# Altium project c1-12.PrjPCB (part 2 of 3)

## Sheet one_planar_sensor_connector_hall_crossboard_1_1.SchDoc
size A3
Used 8 times, as channels U_AD7768_inputs_hall_crossboard_1_1/meas_ch1, U_AD7768_inputs_hall_crossboard_1_1/meas_ch2, U_AD7768_inputs_hall_crossboard_1_1/meas_ch3, U_AD7768_inputs_hall_crossboard_1_1/meas_ch4, U_AD7768_inputs_hall_crossboard_1_1/meas_ch5, U_AD7768_inputs_hall_crossboard_1_1/meas_ch6, U_AD7768_inputs_hall_crossboard_1_1/meas_ch7, U_AD7768_inputs_hall_crossboard_1_1/meas_ch8. Parts and nets are listed once, with the designators drawn on the sheet.
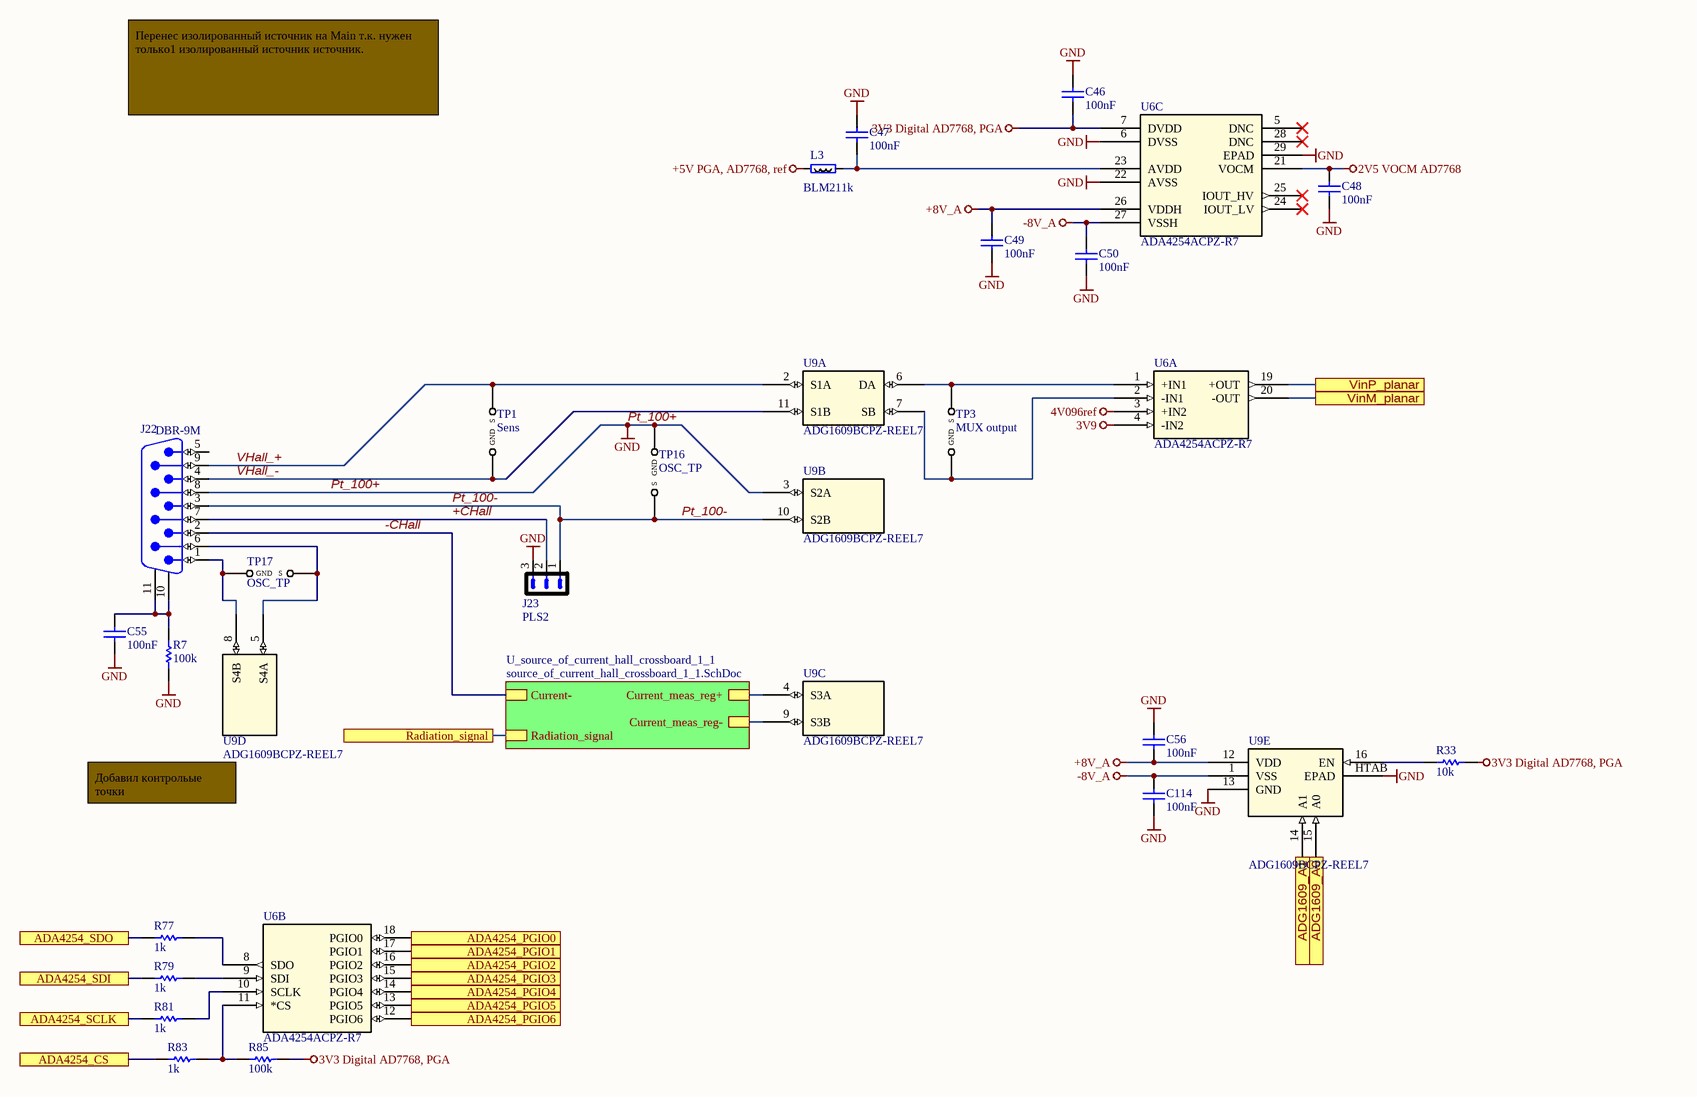
[diagram p7: one_planar_sensor_connector_hall_crossboard_1_1.SchDoc]

### Parts
C46  100nF  [0603C]
C47  100nF  [0603C]
C48  100nF  [0603C]
C49  100nF  [0603C]
C50  100nF  [0603C]
C55  100nF  [0603C]
C56  100nF  [0603C]
C114  100nF  [0603C]
J22  DBR-9M  [AMPHENOL_L717DFE09P1ATN]
J23  PLS2  [COMATEL_385.0358.1.03.400]
L3  BLM211k  [RESC2012X50N]
R7  100k  [0603R]
R33  10k  [0603R]
R77  1k  [0603R]
R79  1k  [0603R]
R81  1k  [0603R]
R83  1k  [0603R]
R85  100k  [0603R]
TP1  Sens  [TP2]
TP3  MUX output  [TP2]
TP16  OSC_TP  [TP2]
TP17  OSC_TP  [TP2]
U6  ADA4254ACPZ-R7  [CP-28-10_ADI-M]  (parts A,B,C of 3)
U9  ADG1609BCPZ-REEL7  [CP_16_22_ADI-M]  (parts A,B,C,D,E of 5)

### Sub-sheets
U_source_of_current_hall_crossboard_1_1 = source_of_current_hall_crossboard_1_1.SchDoc: Current-, Current_meas_reg+, Current_meas_reg-, Radiation_signal

### Ports
ADA4254_CS, ADA4254_PGIO0, ADA4254_PGIO1, ADA4254_PGIO2, ADA4254_PGIO3, ADA4254_PGIO4, ADA4254_PGIO5, ADA4254_PGIO6, ADA4254_SCLK, ADA4254_SDI, ADA4254_SDO, ADG1609_A0, ADG1609_A1, Radiation_signal, VinM_planar, VinP_planar

### Nets
2V5 VOCM AD7768: C48.2 U6.21(VOCM)
3V3 Digital AD7768, PGA: C46.1 R85.2 U6.7(DVDD)
3V9: U6.4(-IN2)
4V096ref: U6.3(+IN2)
+5V PGA, AD7768, ref: L3.1
+8V_A: C49.2 C56.1 U6.26(VDDH) U9.12(VDD)
-8V_A: C50.2 C114.2 U6.27(VSSH) U9.1(VSS)
Pt_100+: C46.2 C47.1 C48.1 C49.1 C50.1 C55.1 C56.2 C114.1 J22.8 J23.3 R7.1 TP16.2(GND) U6.6(DVSS) U6.22(AVSS) U6.29(EPAD) U9.3(S2A) U9.13(GND) U9.HTAB(EPAD)  [also labelled GND]
+CHall: J22.7 J23.2
-CHall: J22.2 ; sheet U_source_of_current_hall_crossboard_1_1/Current-
ADA4254_CS: R83.1 ; port ADA4254_CS
ADA4254_PGIO0: U6.18(PGIO0) ; port ADA4254_PGIO0
ADA4254_PGIO1: U6.17(PGIO1) ; port ADA4254_PGIO1
ADA4254_PGIO2: U6.16(PGIO2) ; port ADA4254_PGIO2
ADA4254_PGIO3: U6.15(PGIO3) ; port ADA4254_PGIO3
ADA4254_PGIO4: U6.14(PGIO4) ; port ADA4254_PGIO4
ADA4254_PGIO5: U6.13(PGIO5) ; port ADA4254_PGIO5
ADA4254_PGIO6: U6.12(PGIO6) ; port ADA4254_PGIO6
ADA4254_SCLK: R81.1 ; port ADA4254_SCLK
ADA4254_SDI: R79.1 ; port ADA4254_SDI
ADA4254_SDO: R77.1 ; port ADA4254_SDO
ADG1609_A0: U9.15(A0) ; port ADG1609_A0
ADG1609_A1: U9.14(A1) ; port ADG1609_A1
Pt_100-: J22.3 J23.1 TP16.1(S) U9.10(S2B)
Radiation_signal: port Radiation_signal, sheet U_source_of_current_hall_crossboard_1_1/Radiation_signal
VHall_+: J22.9 TP1.1(S) U9.2(S1A)
VHall_-: J22.4 TP1.2(GND) U9.11(S1B)
VinM_planar: U6.20(-OUT) ; port VinM_planar
VinP_planar: U6.19(+OUT) ; port VinP_planar
NetC47_2: C47.2 L3.2 U6.23(AVDD)
NetC55_2: C55.2 J22.10 J22.11 R7.2
NetJ22_1: J22.1 TP17.2(GND) U9.8(S4B)
NetJ22_6: J22.6 TP17.1(S) U9.5(S4A)
NetR33_1: R33.1 U9.16(EN)
NetR77_2: R77.2 U6.8(SDO)
NetR79_2: R79.2 U6.9(SDI)
NetR81_2: R81.2 U6.10(SCLK)
NetR83_2: R83.2 R85.1 U6.11(*CS)
NetTP3_1: TP3.1(S) U6.1(+IN1) U9.6(DA)
NetTP3_2: TP3.2(GND) U6.2(-IN1) U9.7(SB)
NetU9_4: U9.4(S3A) ; sheet U_source_of_current_hall_crossboard_1_1/Current_meas_reg+
NetU9_9: U9.9(S3B) ; sheet U_source_of_current_hall_crossboard_1_1/Current_meas_reg-

Not connected (* = marked no-connect by the designer): J22 5; R33 2; U6 5(DNC)* 24(IOUT_LV)* 25(IOUT_HV)* 28(DNC)*

### Channels
U_AD7768_inputs_hall_crossboard_1_1/meas_ch1: designators C46=meas_ch1_C46 C47=meas_ch1_C47 C48=meas_ch1_C48 C49=meas_ch1_C49 C50=meas_ch1_C50 C55=meas_ch1_C55 C56=meas_ch1_C56 C114=meas_ch1_C114 J22=meas_ch1_J22 J23=meas_ch1_J23 L3=meas_ch1_L3 R7=meas_ch1_R7 R33=meas_ch1_R33 R77=meas_ch1_R77 R79=meas_ch1_R79 R81=meas_ch1_R81 R83=meas_ch1_R83 R85=meas_ch1_R85 TP1=meas_ch1_TP1 TP3=meas_ch1_TP3 TP16=meas_ch1_TP16 TP17=meas_ch1_TP17 U6=meas_ch1_U6 U9=meas_ch1_U9; ports ADA4254_CS=ADA4254_CS ADA4254_PGIO0=ADA4254_PGIO0 ADA4254_PGIO1=ADA4254_PGIO1 ADA4254_PGIO2=ADA4254_PGIO2 ADA4254_PGIO3=ADA4254_PGIO3 ADA4254_PGIO4=ADA4254_PGIO4 ADA4254_PGIO5=Netmeas_ch1_U6_13 ADA4254_PGIO6=Netmeas_ch1_U6_12 ADA4254_SCLK=SCLK ADA4254_SDI=MOSI ADA4254_SDO=MISO ADG1609_A0=ADG1609_A0 ADG1609_A1=ADG1609_A1 Radiation_signal=Radiation_signal VinM_planar=VinM_planar1 VinP_planar=VinP_planar1
U_AD7768_inputs_hall_crossboard_1_1/meas_ch2: designators C46=meas_ch2_C46 C47=meas_ch2_C47 C48=meas_ch2_C48 C49=meas_ch2_C49 C50=meas_ch2_C50 C55=meas_ch2_C55 C56=meas_ch2_C56 C114=meas_ch2_C114 J22=meas_ch2_J22 J23=meas_ch2_J23 L3=meas_ch2_L3 R7=meas_ch2_R7 R33=meas_ch2_R33 R77=meas_ch2_R77 R79=meas_ch2_R79 R81=meas_ch2_R81 R83=meas_ch2_R83 R85=meas_ch2_R85 TP1=meas_ch2_TP1 TP3=meas_ch2_TP3 TP16=meas_ch2_TP16 TP17=meas_ch2_TP17 U6=meas_ch2_U6 U9=meas_ch2_U9; ports ADA4254_CS=ADA4254_CS ADA4254_PGIO0=ADA4254_PGIO0 ADA4254_PGIO1=ADA4254_PGIO1 ADA4254_PGIO2=ADA4254_PGIO2 ADA4254_PGIO3=ADA4254_PGIO3 ADA4254_PGIO4=ADA4254_PGIO4 ADA4254_PGIO5=Netmeas_ch1_U6_13 ADA4254_PGIO6=Netmeas_ch1_U6_12 ADA4254_SCLK=SCLK ADA4254_SDI=MOSI ADA4254_SDO=MISO ADG1609_A0=ADG1609_A0 ADG1609_A1=ADG1609_A1 Radiation_signal=Radiation_signal VinM_planar=VinM_planar2 VinP_planar=VinP_planar2
U_AD7768_inputs_hall_crossboard_1_1/meas_ch3: designators C46=meas_ch3_C46 C47=meas_ch3_C47 C48=meas_ch3_C48 C49=meas_ch3_C49 C50=meas_ch3_C50 C55=meas_ch3_C55 C56=meas_ch3_C56 C114=meas_ch3_C114 J22=meas_ch3_J22 J23=meas_ch3_J23 L3=meas_ch3_L3 R7=meas_ch3_R7 R33=meas_ch3_R33 R77=meas_ch3_R77 R79=meas_ch3_R79 R81=meas_ch3_R81 R83=meas_ch3_R83 R85=meas_ch3_R85 TP1=meas_ch3_TP1 TP3=meas_ch3_TP3 TP16=meas_ch3_TP16 TP17=meas_ch3_TP17 U6=meas_ch3_U6 U9=meas_ch3_U9; ports ADA4254_CS=ADA4254_CS ADA4254_PGIO0=ADA4254_PGIO0 ADA4254_PGIO1=ADA4254_PGIO1 ADA4254_PGIO2=ADA4254_PGIO2 ADA4254_PGIO3=ADA4254_PGIO3 ADA4254_PGIO4=ADA4254_PGIO4 ADA4254_PGIO5=Netmeas_ch1_U6_13 ADA4254_PGIO6=Netmeas_ch1_U6_12 ADA4254_SCLK=SCLK ADA4254_SDI=MOSI ADA4254_SDO=MISO ADG1609_A0=ADG1609_A0 ADG1609_A1=ADG1609_A1 Radiation_signal=Radiation_signal VinM_planar=VinM_planar3 VinP_planar=VinP_planar3
U_AD7768_inputs_hall_crossboard_1_1/meas_ch4: designators C46=meas_ch4_C46 C47=meas_ch4_C47 C48=meas_ch4_C48 C49=meas_ch4_C49 C50=meas_ch4_C50 C55=meas_ch4_C55 C56=meas_ch4_C56 C114=meas_ch4_C114 J22=meas_ch4_J22 J23=meas_ch4_J23 L3=meas_ch4_L3 R7=meas_ch4_R7 R33=meas_ch4_R33 R77=meas_ch4_R77 R79=meas_ch4_R79 R81=meas_ch4_R81 R83=meas_ch4_R83 R85=meas_ch4_R85 TP1=meas_ch4_TP1 TP3=meas_ch4_TP3 TP16=meas_ch4_TP16 TP17=meas_ch4_TP17 U6=meas_ch4_U6 U9=meas_ch4_U9; ports ADA4254_CS=ADA4254_CS ADA4254_PGIO0=ADA4254_PGIO0 ADA4254_PGIO1=ADA4254_PGIO1 ADA4254_PGIO2=ADA4254_PGIO2 ADA4254_PGIO3=ADA4254_PGIO3 ADA4254_PGIO4=ADA4254_PGIO4 ADA4254_PGIO5=Netmeas_ch1_U6_13 ADA4254_PGIO6=Netmeas_ch1_U6_12 ADA4254_SCLK=SCLK ADA4254_SDI=MOSI ADA4254_SDO=MISO ADG1609_A0=ADG1609_A0 ADG1609_A1=ADG1609_A1 Radiation_signal=Radiation_signal VinM_planar=VinM_planar4 VinP_planar=VinP_planar4
U_AD7768_inputs_hall_crossboard_1_1/meas_ch5: designators C46=meas_ch5_C46 C47=meas_ch5_C47 C48=meas_ch5_C48 C49=meas_ch5_C49 C50=meas_ch5_C50 C55=meas_ch5_C55 C56=meas_ch5_C56 C114=meas_ch5_C114 J22=meas_ch5_J22 J23=meas_ch5_J23 L3=meas_ch5_L3 R7=meas_ch5_R7 R33=meas_ch5_R33 R77=meas_ch5_R77 R79=meas_ch5_R79 R81=meas_ch5_R81 R83=meas_ch5_R83 R85=meas_ch5_R85 TP1=meas_ch5_TP1 TP3=meas_ch5_TP3 TP16=meas_ch5_TP16 TP17=meas_ch5_TP17 U6=meas_ch5_U6 U9=meas_ch5_U9; ports ADA4254_CS=ADA4254_CS ADA4254_PGIO0=ADA4254_PGIO0 ADA4254_PGIO1=ADA4254_PGIO1 ADA4254_PGIO2=ADA4254_PGIO2 ADA4254_PGIO3=ADA4254_PGIO3 ADA4254_PGIO4=ADA4254_PGIO4 ADA4254_PGIO5=Netmeas_ch1_U6_13 ADA4254_PGIO6=Netmeas_ch1_U6_12 ADA4254_SCLK=SCLK ADA4254_SDI=MOSI ADA4254_SDO=MISO ADG1609_A0=ADG1609_A0 ADG1609_A1=ADG1609_A1 Radiation_signal=Radiation_signal VinM_planar=VinM_planar5 VinP_planar=VinP_planar5
U_AD7768_inputs_hall_crossboard_1_1/meas_ch6: designators C46=meas_ch6_C46 C47=meas_ch6_C47 C48=meas_ch6_C48 C49=meas_ch6_C49 C50=meas_ch6_C50 C55=meas_ch6_C55 C56=meas_ch6_C56 C114=meas_ch6_C114 J22=meas_ch6_J22 J23=meas_ch6_J23 L3=meas_ch6_L3 R7=meas_ch6_R7 R33=meas_ch6_R33 R77=meas_ch6_R77 R79=meas_ch6_R79 R81=meas_ch6_R81 R83=meas_ch6_R83 R85=meas_ch6_R85 TP1=meas_ch6_TP1 TP3=meas_ch6_TP3 TP16=meas_ch6_TP16 TP17=meas_ch6_TP17 U6=meas_ch6_U6 U9=meas_ch6_U9; ports ADA4254_CS=ADA4254_CS ADA4254_PGIO0=ADA4254_PGIO0 ADA4254_PGIO1=ADA4254_PGIO1 ADA4254_PGIO2=ADA4254_PGIO2 ADA4254_PGIO3=ADA4254_PGIO3 ADA4254_PGIO4=ADA4254_PGIO4 ADA4254_PGIO5=Netmeas_ch1_U6_13 ADA4254_PGIO6=Netmeas_ch1_U6_12 ADA4254_SCLK=SCLK ADA4254_SDI=MOSI ADA4254_SDO=MISO ADG1609_A0=ADG1609_A0 ADG1609_A1=ADG1609_A1 Radiation_signal=Radiation_signal VinM_planar=VinM_planar6 VinP_planar=VinP_planar6
U_AD7768_inputs_hall_crossboard_1_1/meas_ch7: designators C46=meas_ch7_C46 C47=meas_ch7_C47 C48=meas_ch7_C48 C49=meas_ch7_C49 C50=meas_ch7_C50 C55=meas_ch7_C55 C56=meas_ch7_C56 C114=meas_ch7_C114 J22=meas_ch7_J22 J23=meas_ch7_J23 L3=meas_ch7_L3 R7=meas_ch7_R7 R33=meas_ch7_R33 R77=meas_ch7_R77 R79=meas_ch7_R79 R81=meas_ch7_R81 R83=meas_ch7_R83 R85=meas_ch7_R85 TP1=meas_ch7_TP1 TP3=meas_ch7_TP3 TP16=meas_ch7_TP16 TP17=meas_ch7_TP17 U6=meas_ch7_U6 U9=meas_ch7_U9; ports ADA4254_CS=ADA4254_CS ADA4254_PGIO0=ADA4254_PGIO0 ADA4254_PGIO1=ADA4254_PGIO1 ADA4254_PGIO2=ADA4254_PGIO2 ADA4254_PGIO3=ADA4254_PGIO3 ADA4254_PGIO4=ADA4254_PGIO4 ADA4254_PGIO5=Netmeas_ch1_U6_13 ADA4254_PGIO6=Netmeas_ch1_U6_12 ADA4254_SCLK=SCLK ADA4254_SDI=MOSI ADA4254_SDO=MISO ADG1609_A0=ADG1609_A0 ADG1609_A1=ADG1609_A1 Radiation_signal=Radiation_signal VinM_planar=VinM_planar7 VinP_planar=VinP_planar7
U_AD7768_inputs_hall_crossboard_1_1/meas_ch8: designators C46=meas_ch8_C46 C47=meas_ch8_C47 C48=meas_ch8_C48 C49=meas_ch8_C49 C50=meas_ch8_C50 C55=meas_ch8_C55 C56=meas_ch8_C56 C114=meas_ch8_C114 J22=meas_ch8_J22 J23=meas_ch8_J23 L3=meas_ch8_L3 R7=meas_ch8_R7 R33=meas_ch8_R33 R77=meas_ch8_R77 R79=meas_ch8_R79 R81=meas_ch8_R81 R83=meas_ch8_R83 R85=meas_ch8_R85 TP1=meas_ch8_TP1 TP3=meas_ch8_TP3 TP16=meas_ch8_TP16 TP17=meas_ch8_TP17 U6=meas_ch8_U6 U9=meas_ch8_U9; ports ADA4254_CS=ADA4254_CS ADA4254_PGIO0=ADA4254_PGIO0 ADA4254_PGIO1=ADA4254_PGIO1 ADA4254_PGIO2=ADA4254_PGIO2 ADA4254_PGIO3=ADA4254_PGIO3 ADA4254_PGIO4=ADA4254_PGIO4 ADA4254_PGIO5=Netmeas_ch1_U6_13 ADA4254_PGIO6=Netmeas_ch1_U6_12 ADA4254_SCLK=SCLK ADA4254_SDI=MOSI ADA4254_SDO=MISO ADG1609_A0=ADG1609_A0 ADG1609_A1=ADG1609_A1 Radiation_signal=Radiation_signal VinM_planar=VinM_planar8 VinP_planar=VinP_planar8

### Notes on the sheet
- Перенес изолированный источник на Main т.к. нужен только1 изолированный источник источник.
- Добавил контрольые точки
- Labels drawn without touching a wire or pin: 3V3 Digital AD7768, PGA

### Library data of the parts
C46-C50 C55 C56 C114 = Capacitor_ST: Capacitor 0402 / 0603 / 0805; Revision: July-2002: Re-released for DXP Platform.; Value: 100nF
J22 = D_SUB_9M: Вилка  DSUB 9 угловая; Vendor: Connfly; SMD Solders: 0; Solder Option: RM; THD Solders: 11; Name to order: DRB- 9MA (DBR-9M) (DS1037-9M); Price: 50; Device: DBR-9M
J23 = PLS3: Vendor: Confly; SMD Solders: 0; Solder Option: RM; THD Solders: 2; Price: 1; Device: PLS2
L3 = BLM21: SMD Ferrite bead 0805; Vendor: Vishay; Value: 1k; Pkg: SMD0805; SMD Solders: 2; Solder Option: RM; Device: BLM21; Price: 10
R7 R33 R77 R79 R81 R83 R85 = Resistor_ST: Resistor 0402 / 0603 / 0805
  R7 R85: Value: 100k
  R33: Value: 10k
  R77 R79 R81 R83: Value: 1k
TP1 TP3 TP16 TP17 = OscTP: Контрольная точка для подключения осциллографа короткой землёй; Vendor: PCB; Price: 0; SolderOption: PCB
  TP1: Value: Sens
  TP3: Value: MUX output
  TP16 TP17: Value: OSC_TP
U6 = ADA4254ACPZ-R7: No Description Available; Mfr_Name: Analog Devices Inc; Digi-Key_Part_Number_1: 505-ADA4254ACPZ-R7TR-ND; RefDes: RefDes; Type: Type
U9 = ADG1609BCPZ-REEL7: No Description Available; Mfr_Name: Analog Devices Inc; RefDes: RefDes; Type: Type

## Sheet source_of_current_hall_crossboard_1_1.SchDoc
size A4
Used 8 times, as channels U_AD7768_inputs_hall_crossboard_1_1/meas_ch1/U_source_of_current_hall_crossboard_1_1, U_AD7768_inputs_hall_crossboard_1_1/meas_ch2/U_source_of_current_hall_crossboard_1_1, U_AD7768_inputs_hall_crossboard_1_1/meas_ch3/U_source_of_current_hall_crossboard_1_1, U_AD7768_inputs_hall_crossboard_1_1/meas_ch4/U_source_of_current_hall_crossboard_1_1, U_AD7768_inputs_hall_crossboard_1_1/meas_ch5/U_source_of_current_hall_crossboard_1_1, U_AD7768_inputs_hall_crossboard_1_1/meas_ch6/U_source_of_current_hall_crossboard_1_1, U_AD7768_inputs_hall_crossboard_1_1/meas_ch7/U_source_of_current_hall_crossboard_1_1, U_AD7768_inputs_hall_crossboard_1_1/meas_ch8/U_source_of_current_hall_crossboard_1_1. Parts and nets are listed once, with the designators drawn on the sheet.
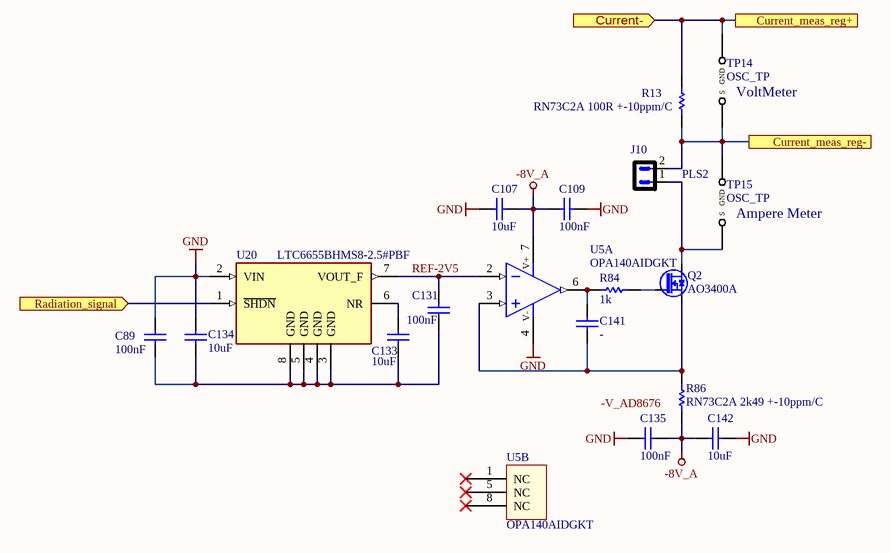
[diagram p8: source_of_current_hall_crossboard_1_1.SchDoc]

### Parts
C89  100nF  [0603C]
C107  10uF  [0805C]
C109  100nF  [0603C]
C131  100nF  [0603C]
C133  10uF  [0805C]
C134  10uF  [0805C]
C135  100nF  [0603C]
C141  -  [0603C]
C142  10uF  [0805C]
J10  PLS2  [SAMTEC_TSW-102-23-L-S]
Q2  AO3400A  [SOT95P229X119-3N]
R13  RN73C2A 100R +-10ppm/C  [0805R]
R84  1k  [0805R]
R86  RN73C2A 2k49 +-10ppm/C  [0805R]
TP14  OSC_TP  [TP2]
TP15  OSC_TP  [TP2]
U5  OPA140AIDGKT  [SOP65P490X110-8N]  (parts A,B of 2)
U20  LTC6655BHMS8-2.5#PBF  [SOP65P490X110-8N]

### Ports
Current- (in), Current_meas_reg+, Current_meas_reg-, Radiation_signal (in)

### Nets
-8V_A: C107.1 C109.1 C135.1 C142.1 R86.1 U5.7(V+)
GND: C89.2 C107.2 C109.2 C134.2 C135.2 C142.2 U5.4(V-) U20.2(VIN)
Current-: R13.2 TP14.2(GND) ; port Current-, port Current_meas_reg+
Current_meas_reg-: J10.2 R13.1 TP14.1(S) TP15.2(GND) ; port Current_meas_reg-
Radiation_signal: U20.1(~{SHDN}) ; port Radiation_signal
REF-2V5: C131.2 U5.2(IN-) U20.7(VOUT_F)
NetC89_1: C89.1 C131.1 C133.1 C134.1 U20.3(GND) U20.4(GND) U20.5(GND) U20.8(GND)
NetC133_2: C133.2 U20.6(NR)
NetC141_1: C141.1 Q2.2(S) R86.2 U5.3(IN+)
NetC141_2: C141.2 R84.1 U5.6(OUT)
NetJ10_1: J10.1 Q2.3(D) TP15.1(S)
NetQ2_1: Q2.1(G) R84.2

Not connected (* = marked no-connect by the designer): U5 1(NC)* 5(NC)* 8(NC)*

### Channels
U_AD7768_inputs_hall_crossboard_1_1/meas_ch1/U_source_of_current_hall_crossboard_1_1: designators C89=U_AD7768_inputs_hall_crossboard_1_1_meas_ch1_U_source_of_current_hall_crossboard_1_1_C89 C107=U_AD7768_inputs_hall_crossboard_1_1_meas_ch1_U_source_of_current_hall_crossboard_1_1_C107 C109=U_AD7768_inputs_hall_crossboard_1_1_meas_ch1_U_source_of_current_hall_crossboard_1_1_C109 C131=U_AD7768_inputs_hall_crossboard_1_1_meas_ch1_U_source_of_current_hall_crossboard_1_1_C131 C133=U_AD7768_inputs_hall_crossboard_1_1_meas_ch1_U_source_of_current_hall_crossboard_1_1_C133 C134=U_AD7768_inputs_hall_crossboard_1_1_meas_ch1_U_source_of_current_hall_crossboard_1_1_C134 C135=U_AD7768_inputs_hall_crossboard_1_1_meas_ch1_U_source_of_current_hall_crossboard_1_1_C135 C141=U_AD7768_inputs_hall_crossboard_1_1_meas_ch1_U_source_of_current_hall_crossboard_1_1_C141 C142=U_AD7768_inputs_hall_crossboard_1_1_meas_ch1_U_source_of_current_hall_crossboard_1_1_C142 J10=U_AD7768_inputs_hall_crossboard_1_1_meas_ch1_U_source_of_current_hall_crossboard_1_1_J10 Q2=U_AD7768_inputs_hall_crossboard_1_1_meas_ch1_U_source_of_current_hall_crossboard_1_1_Q2 R13=U_AD7768_inputs_hall_crossboard_1_1_meas_ch1_U_source_of_current_hall_crossboard_1_1_R13 R84=U_AD7768_inputs_hall_crossboard_1_1_meas_ch1_U_source_of_current_hall_crossboard_1_1_R84 R86=U_AD7768_inputs_hall_crossboard_1_1_meas_ch1_U_source_of_current_hall_crossboard_1_1_R86 TP14=U_AD7768_inputs_hall_crossboard_1_1_meas_ch1_U_source_of_current_hall_crossboard_1_1_TP14 TP15=U_AD7768_inputs_hall_crossboard_1_1_meas_ch1_U_source_of_current_hall_crossboard_1_1_TP15 U5=U_AD7768_inputs_hall_crossboard_1_1_meas_ch1_U_source_of_current_hall_crossboard_1_1_U5 U20=U_AD7768_inputs_hall_crossboard_1_1_meas_ch1_U_source_of_current_hall_crossboard_1_1_U20; ports Current-=-CHall_meas_ch1 Current_meas_reg+=-CHall_meas_ch1 Current_meas_reg-=Netmeas_ch1_U9_9 Radiation_signal=Radiation_signal
U_AD7768_inputs_hall_crossboard_1_1/meas_ch2/U_source_of_current_hall_crossboard_1_1: designators C89=U_AD7768_inputs_hall_crossboard_1_1_meas_ch2_U_source_of_current_hall_crossboard_1_1_C89 C107=U_AD7768_inputs_hall_crossboard_1_1_meas_ch2_U_source_of_current_hall_crossboard_1_1_C107 C109=U_AD7768_inputs_hall_crossboard_1_1_meas_ch2_U_source_of_current_hall_crossboard_1_1_C109 C131=U_AD7768_inputs_hall_crossboard_1_1_meas_ch2_U_source_of_current_hall_crossboard_1_1_C131 C133=U_AD7768_inputs_hall_crossboard_1_1_meas_ch2_U_source_of_current_hall_crossboard_1_1_C133 C134=U_AD7768_inputs_hall_crossboard_1_1_meas_ch2_U_source_of_current_hall_crossboard_1_1_C134 C135=U_AD7768_inputs_hall_crossboard_1_1_meas_ch2_U_source_of_current_hall_crossboard_1_1_C135 C141=U_AD7768_inputs_hall_crossboard_1_1_meas_ch2_U_source_of_current_hall_crossboard_1_1_C141 C142=U_AD7768_inputs_hall_crossboard_1_1_meas_ch2_U_source_of_current_hall_crossboard_1_1_C142 J10=U_AD7768_inputs_hall_crossboard_1_1_meas_ch2_U_source_of_current_hall_crossboard_1_1_J10 Q2=U_AD7768_inputs_hall_crossboard_1_1_meas_ch2_U_source_of_current_hall_crossboard_1_1_Q2 R13=U_AD7768_inputs_hall_crossboard_1_1_meas_ch2_U_source_of_current_hall_crossboard_1_1_R13 R84=U_AD7768_inputs_hall_crossboard_1_1_meas_ch2_U_source_of_current_hall_crossboard_1_1_R84 R86=U_AD7768_inputs_hall_crossboard_1_1_meas_ch2_U_source_of_current_hall_crossboard_1_1_R86 TP14=U_AD7768_inputs_hall_crossboard_1_1_meas_ch2_U_source_of_current_hall_crossboard_1_1_TP14 TP15=U_AD7768_inputs_hall_crossboard_1_1_meas_ch2_U_source_of_current_hall_crossboard_1_1_TP15 U5=U_AD7768_inputs_hall_crossboard_1_1_meas_ch2_U_source_of_current_hall_crossboard_1_1_U5 U20=U_AD7768_inputs_hall_crossboard_1_1_meas_ch2_U_source_of_current_hall_crossboard_1_1_U20; ports Current-=-CHall_meas_ch2 Current_meas_reg+=-CHall_meas_ch2 Current_meas_reg-=Netmeas_ch2_U9_9 Radiation_signal=Radiation_signal
U_AD7768_inputs_hall_crossboard_1_1/meas_ch3/U_source_of_current_hall_crossboard_1_1: designators C89=U_AD7768_inputs_hall_crossboard_1_1_meas_ch3_U_source_of_current_hall_crossboard_1_1_C89 C107=U_AD7768_inputs_hall_crossboard_1_1_meas_ch3_U_source_of_current_hall_crossboard_1_1_C107 C109=U_AD7768_inputs_hall_crossboard_1_1_meas_ch3_U_source_of_current_hall_crossboard_1_1_C109 C131=U_AD7768_inputs_hall_crossboard_1_1_meas_ch3_U_source_of_current_hall_crossboard_1_1_C131 C133=U_AD7768_inputs_hall_crossboard_1_1_meas_ch3_U_source_of_current_hall_crossboard_1_1_C133 C134=U_AD7768_inputs_hall_crossboard_1_1_meas_ch3_U_source_of_current_hall_crossboard_1_1_C134 C135=U_AD7768_inputs_hall_crossboard_1_1_meas_ch3_U_source_of_current_hall_crossboard_1_1_C135 C141=U_AD7768_inputs_hall_crossboard_1_1_meas_ch3_U_source_of_current_hall_crossboard_1_1_C141 C142=U_AD7768_inputs_hall_crossboard_1_1_meas_ch3_U_source_of_current_hall_crossboard_1_1_C142 J10=U_AD7768_inputs_hall_crossboard_1_1_meas_ch3_U_source_of_current_hall_crossboard_1_1_J10 Q2=U_AD7768_inputs_hall_crossboard_1_1_meas_ch3_U_source_of_current_hall_crossboard_1_1_Q2 R13=U_AD7768_inputs_hall_crossboard_1_1_meas_ch3_U_source_of_current_hall_crossboard_1_1_R13 R84=U_AD7768_inputs_hall_crossboard_1_1_meas_ch3_U_source_of_current_hall_crossboard_1_1_R84 R86=U_AD7768_inputs_hall_crossboard_1_1_meas_ch3_U_source_of_current_hall_crossboard_1_1_R86 TP14=U_AD7768_inputs_hall_crossboard_1_1_meas_ch3_U_source_of_current_hall_crossboard_1_1_TP14 TP15=U_AD7768_inputs_hall_crossboard_1_1_meas_ch3_U_source_of_current_hall_crossboard_1_1_TP15 U5=U_AD7768_inputs_hall_crossboard_1_1_meas_ch3_U_source_of_current_hall_crossboard_1_1_U5 U20=U_AD7768_inputs_hall_crossboard_1_1_meas_ch3_U_source_of_current_hall_crossboard_1_1_U20; ports Current-=-CHall_meas_ch3 Current_meas_reg+=-CHall_meas_ch3 Current_meas_reg-=Netmeas_ch3_U9_9 Radiation_signal=Radiation_signal
U_AD7768_inputs_hall_crossboard_1_1/meas_ch4/U_source_of_current_hall_crossboard_1_1: designators C89=U_AD7768_inputs_hall_crossboard_1_1_meas_ch4_U_source_of_current_hall_crossboard_1_1_C89 C107=U_AD7768_inputs_hall_crossboard_1_1_meas_ch4_U_source_of_current_hall_crossboard_1_1_C107 C109=U_AD7768_inputs_hall_crossboard_1_1_meas_ch4_U_source_of_current_hall_crossboard_1_1_C109 C131=U_AD7768_inputs_hall_crossboard_1_1_meas_ch4_U_source_of_current_hall_crossboard_1_1_C131 C133=U_AD7768_inputs_hall_crossboard_1_1_meas_ch4_U_source_of_current_hall_crossboard_1_1_C133 C134=U_AD7768_inputs_hall_crossboard_1_1_meas_ch4_U_source_of_current_hall_crossboard_1_1_C134 C135=U_AD7768_inputs_hall_crossboard_1_1_meas_ch4_U_source_of_current_hall_crossboard_1_1_C135 C141=U_AD7768_inputs_hall_crossboard_1_1_meas_ch4_U_source_of_current_hall_crossboard_1_1_C141 C142=U_AD7768_inputs_hall_crossboard_1_1_meas_ch4_U_source_of_current_hall_crossboard_1_1_C142 J10=U_AD7768_inputs_hall_crossboard_1_1_meas_ch4_U_source_of_current_hall_crossboard_1_1_J10 Q2=U_AD7768_inputs_hall_crossboard_1_1_meas_ch4_U_source_of_current_hall_crossboard_1_1_Q2 R13=U_AD7768_inputs_hall_crossboard_1_1_meas_ch4_U_source_of_current_hall_crossboard_1_1_R13 R84=U_AD7768_inputs_hall_crossboard_1_1_meas_ch4_U_source_of_current_hall_crossboard_1_1_R84 R86=U_AD7768_inputs_hall_crossboard_1_1_meas_ch4_U_source_of_current_hall_crossboard_1_1_R86 TP14=U_AD7768_inputs_hall_crossboard_1_1_meas_ch4_U_source_of_current_hall_crossboard_1_1_TP14 TP15=U_AD7768_inputs_hall_crossboard_1_1_meas_ch4_U_source_of_current_hall_crossboard_1_1_TP15 U5=U_AD7768_inputs_hall_crossboard_1_1_meas_ch4_U_source_of_current_hall_crossboard_1_1_U5 U20=U_AD7768_inputs_hall_crossboard_1_1_meas_ch4_U_source_of_current_hall_crossboard_1_1_U20; ports Current-=-CHall_meas_ch4 Current_meas_reg+=-CHall_meas_ch4 Current_meas_reg-=Netmeas_ch4_U9_9 Radiation_signal=Radiation_signal
U_AD7768_inputs_hall_crossboard_1_1/meas_ch5/U_source_of_current_hall_crossboard_1_1: designators C89=U_AD7768_inputs_hall_crossboard_1_1_meas_ch5_U_source_of_current_hall_crossboard_1_1_C89 C107=U_AD7768_inputs_hall_crossboard_1_1_meas_ch5_U_source_of_current_hall_crossboard_1_1_C107 C109=U_AD7768_inputs_hall_crossboard_1_1_meas_ch5_U_source_of_current_hall_crossboard_1_1_C109 C131=U_AD7768_inputs_hall_crossboard_1_1_meas_ch5_U_source_of_current_hall_crossboard_1_1_C131 C133=U_AD7768_inputs_hall_crossboard_1_1_meas_ch5_U_source_of_current_hall_crossboard_1_1_C133 C134=U_AD7768_inputs_hall_crossboard_1_1_meas_ch5_U_source_of_current_hall_crossboard_1_1_C134 C135=U_AD7768_inputs_hall_crossboard_1_1_meas_ch5_U_source_of_current_hall_crossboard_1_1_C135 C141=U_AD7768_inputs_hall_crossboard_1_1_meas_ch5_U_source_of_current_hall_crossboard_1_1_C141 C142=U_AD7768_inputs_hall_crossboard_1_1_meas_ch5_U_source_of_current_hall_crossboard_1_1_C142 J10=U_AD7768_inputs_hall_crossboard_1_1_meas_ch5_U_source_of_current_hall_crossboard_1_1_J10 Q2=U_AD7768_inputs_hall_crossboard_1_1_meas_ch5_U_source_of_current_hall_crossboard_1_1_Q2 R13=U_AD7768_inputs_hall_crossboard_1_1_meas_ch5_U_source_of_current_hall_crossboard_1_1_R13 R84=U_AD7768_inputs_hall_crossboard_1_1_meas_ch5_U_source_of_current_hall_crossboard_1_1_R84 R86=U_AD7768_inputs_hall_crossboard_1_1_meas_ch5_U_source_of_current_hall_crossboard_1_1_R86 TP14=U_AD7768_inputs_hall_crossboard_1_1_meas_ch5_U_source_of_current_hall_crossboard_1_1_TP14 TP15=U_AD7768_inputs_hall_crossboard_1_1_meas_ch5_U_source_of_current_hall_crossboard_1_1_TP15 U5=U_AD7768_inputs_hall_crossboard_1_1_meas_ch5_U_source_of_current_hall_crossboard_1_1_U5 U20=U_AD7768_inputs_hall_crossboard_1_1_meas_ch5_U_source_of_current_hall_crossboard_1_1_U20; ports Current-=-CHall_meas_ch5 Current_meas_reg+=-CHall_meas_ch5 Current_meas_reg-=Netmeas_ch5_U9_9 Radiation_signal=Radiation_signal
U_AD7768_inputs_hall_crossboard_1_1/meas_ch6/U_source_of_current_hall_crossboard_1_1: designators C89=U_AD7768_inputs_hall_crossboard_1_1_meas_ch6_U_source_of_current_hall_crossboard_1_1_C89 C107=U_AD7768_inputs_hall_crossboard_1_1_meas_ch6_U_source_of_current_hall_crossboard_1_1_C107 C109=U_AD7768_inputs_hall_crossboard_1_1_meas_ch6_U_source_of_current_hall_crossboard_1_1_C109 C131=U_AD7768_inputs_hall_crossboard_1_1_meas_ch6_U_source_of_current_hall_crossboard_1_1_C131 C133=U_AD7768_inputs_hall_crossboard_1_1_meas_ch6_U_source_of_current_hall_crossboard_1_1_C133 C134=U_AD7768_inputs_hall_crossboard_1_1_meas_ch6_U_source_of_current_hall_crossboard_1_1_C134 C135=U_AD7768_inputs_hall_crossboard_1_1_meas_ch6_U_source_of_current_hall_crossboard_1_1_C135 C141=U_AD7768_inputs_hall_crossboard_1_1_meas_ch6_U_source_of_current_hall_crossboard_1_1_C141 C142=U_AD7768_inputs_hall_crossboard_1_1_meas_ch6_U_source_of_current_hall_crossboard_1_1_C142 J10=U_AD7768_inputs_hall_crossboard_1_1_meas_ch6_U_source_of_current_hall_crossboard_1_1_J10 Q2=U_AD7768_inputs_hall_crossboard_1_1_meas_ch6_U_source_of_current_hall_crossboard_1_1_Q2 R13=U_AD7768_inputs_hall_crossboard_1_1_meas_ch6_U_source_of_current_hall_crossboard_1_1_R13 R84=U_AD7768_inputs_hall_crossboard_1_1_meas_ch6_U_source_of_current_hall_crossboard_1_1_R84 R86=U_AD7768_inputs_hall_crossboard_1_1_meas_ch6_U_source_of_current_hall_crossboard_1_1_R86 TP14=U_AD7768_inputs_hall_crossboard_1_1_meas_ch6_U_source_of_current_hall_crossboard_1_1_TP14 TP15=U_AD7768_inputs_hall_crossboard_1_1_meas_ch6_U_source_of_current_hall_crossboard_1_1_TP15 U5=U_AD7768_inputs_hall_crossboard_1_1_meas_ch6_U_source_of_current_hall_crossboard_1_1_U5 U20=U_AD7768_inputs_hall_crossboard_1_1_meas_ch6_U_source_of_current_hall_crossboard_1_1_U20; ports Current-=-CHall_meas_ch6 Current_meas_reg+=-CHall_meas_ch6 Current_meas_reg-=Netmeas_ch6_U9_9 Radiation_signal=Radiation_signal
U_AD7768_inputs_hall_crossboard_1_1/meas_ch7/U_source_of_current_hall_crossboard_1_1: designators C89=U_AD7768_inputs_hall_crossboard_1_1_meas_ch7_U_source_of_current_hall_crossboard_1_1_C89 C107=U_AD7768_inputs_hall_crossboard_1_1_meas_ch7_U_source_of_current_hall_crossboard_1_1_C107 C109=U_AD7768_inputs_hall_crossboard_1_1_meas_ch7_U_source_of_current_hall_crossboard_1_1_C109 C131=U_AD7768_inputs_hall_crossboard_1_1_meas_ch7_U_source_of_current_hall_crossboard_1_1_C131 C133=U_AD7768_inputs_hall_crossboard_1_1_meas_ch7_U_source_of_current_hall_crossboard_1_1_C133 C134=U_AD7768_inputs_hall_crossboard_1_1_meas_ch7_U_source_of_current_hall_crossboard_1_1_C134 C135=U_AD7768_inputs_hall_crossboard_1_1_meas_ch7_U_source_of_current_hall_crossboard_1_1_C135 C141=U_AD7768_inputs_hall_crossboard_1_1_meas_ch7_U_source_of_current_hall_crossboard_1_1_C141 C142=U_AD7768_inputs_hall_crossboard_1_1_meas_ch7_U_source_of_current_hall_crossboard_1_1_C142 J10=U_AD7768_inputs_hall_crossboard_1_1_meas_ch7_U_source_of_current_hall_crossboard_1_1_J10 Q2=U_AD7768_inputs_hall_crossboard_1_1_meas_ch7_U_source_of_current_hall_crossboard_1_1_Q2 R13=U_AD7768_inputs_hall_crossboard_1_1_meas_ch7_U_source_of_current_hall_crossboard_1_1_R13 R84=U_AD7768_inputs_hall_crossboard_1_1_meas_ch7_U_source_of_current_hall_crossboard_1_1_R84 R86=U_AD7768_inputs_hall_crossboard_1_1_meas_ch7_U_source_of_current_hall_crossboard_1_1_R86 TP14=U_AD7768_inputs_hall_crossboard_1_1_meas_ch7_U_source_of_current_hall_crossboard_1_1_TP14 TP15=U_AD7768_inputs_hall_crossboard_1_1_meas_ch7_U_source_of_current_hall_crossboard_1_1_TP15 U5=U_AD7768_inputs_hall_crossboard_1_1_meas_ch7_U_source_of_current_hall_crossboard_1_1_U5 U20=U_AD7768_inputs_hall_crossboard_1_1_meas_ch7_U_source_of_current_hall_crossboard_1_1_U20; ports Current-=-CHall_meas_ch7 Current_meas_reg+=-CHall_meas_ch7 Current_meas_reg-=Netmeas_ch7_U9_9 Radiation_signal=Radiation_signal
U_AD7768_inputs_hall_crossboard_1_1/meas_ch8/U_source_of_current_hall_crossboard_1_1: designators C89=U_AD7768_inputs_hall_crossboard_1_1_meas_ch8_U_source_of_current_hall_crossboard_1_1_C89 C107=U_AD7768_inputs_hall_crossboard_1_1_meas_ch8_U_source_of_current_hall_crossboard_1_1_C107 C109=U_AD7768_inputs_hall_crossboard_1_1_meas_ch8_U_source_of_current_hall_crossboard_1_1_C109 C131=U_AD7768_inputs_hall_crossboard_1_1_meas_ch8_U_source_of_current_hall_crossboard_1_1_C131 C133=U_AD7768_inputs_hall_crossboard_1_1_meas_ch8_U_source_of_current_hall_crossboard_1_1_C133 C134=U_AD7768_inputs_hall_crossboard_1_1_meas_ch8_U_source_of_current_hall_crossboard_1_1_C134 C135=U_AD7768_inputs_hall_crossboard_1_1_meas_ch8_U_source_of_current_hall_crossboard_1_1_C135 C141=U_AD7768_inputs_hall_crossboard_1_1_meas_ch8_U_source_of_current_hall_crossboard_1_1_C141 C142=U_AD7768_inputs_hall_crossboard_1_1_meas_ch8_U_source_of_current_hall_crossboard_1_1_C142 J10=U_AD7768_inputs_hall_crossboard_1_1_meas_ch8_U_source_of_current_hall_crossboard_1_1_J10 Q2=U_AD7768_inputs_hall_crossboard_1_1_meas_ch8_U_source_of_current_hall_crossboard_1_1_Q2 R13=U_AD7768_inputs_hall_crossboard_1_1_meas_ch8_U_source_of_current_hall_crossboard_1_1_R13 R84=U_AD7768_inputs_hall_crossboard_1_1_meas_ch8_U_source_of_current_hall_crossboard_1_1_R84 R86=U_AD7768_inputs_hall_crossboard_1_1_meas_ch8_U_source_of_current_hall_crossboard_1_1_R86 TP14=U_AD7768_inputs_hall_crossboard_1_1_meas_ch8_U_source_of_current_hall_crossboard_1_1_TP14 TP15=U_AD7768_inputs_hall_crossboard_1_1_meas_ch8_U_source_of_current_hall_crossboard_1_1_TP15 U5=U_AD7768_inputs_hall_crossboard_1_1_meas_ch8_U_source_of_current_hall_crossboard_1_1_U5 U20=U_AD7768_inputs_hall_crossboard_1_1_meas_ch8_U_source_of_current_hall_crossboard_1_1_U20; ports Current-=-CHall_meas_ch8 Current_meas_reg+=-CHall_meas_ch8 Current_meas_reg-=Netmeas_ch8_U9_9 Radiation_signal=Radiation_signal

### Notes on the sheet
- (near TP14) VoltMeter
- (near TP15) Ampere Meter
- Labels drawn without touching a wire or pin: -V_AD8676

### Library data of the parts
C89 C107 C109 C131 C133-C135 C142 = Capacitor_ST: Capacitor 0402 / 0603 / 0805; Revision: July-2002: Re-released for DXP Platform.
  C89 C109 C131 C135: Value: 100nF
  C107 C133 C134 C142: Value: 10uF
C141 = Capacitor_ST: Capacitor 0402 / 0603 / 0805; Value: 100nF; Revision: July-2002: Re-released for DXP Platform.
J10 = PLS2: Vendor: Confly; SMD Solders: 0; Solder Option: RM; THD Solders: 2; Price: 1; Device: PLS2
Q2 = AO3400A: NMOS; Vendor: UMW; Pkg: SOT23; SMD Solders: 3; Solder Option: RM; Voltage: 30V; Price: 10; Device: AO3400A; Name to order: AO3400A
R13 R86 = Resistor_ST: Resistor 0402 / 0603 / 0805; Value: 10K
R84 = Resistor_ST: Resistor 0402 / 0603 / 080; Value: 1k
TP14 TP15 = OscTP: Контрольная точка для подключения осциллографа короткой землёй; Vendor: PCB; Step: 2; Price: 0; Value: OSC_TP; SolderOption: PCB
U5 = OPA140AIDGKT: Single, 11MHz, Single Supply, Low Noise, Precision, Rail-to-Rail Output, JFET Amplifier 8-VSSOP -40 to 125; MF: Texas Instruments; Purchase-URL: https://pricing.snapeda.com/search/part/OPA140AIDGKT/?ref=eda; SnapEDA_Link: https://www.snapeda.com/parts/OPA140AIDGKT/Texas%20Instruments/view-part/515779/?ref=snap; Value: *; MP: OPA140AIDGKT; Package: VSSOP-8 Texas Instruments; Check_prices: https://www.snapeda.com/parts/OPA140AIDGKT/Texas%20Instruments/view-part/515779/?ref=eda; Price: None; Availability: Good
U20 = LTC6655BHMS8-5#PBF: Series Voltage Reference IC Fixed 5V V Â±0.025% 5 mA 8-MSOP; MF: Analog Devices; Purchase-URL: https://pricing.snapeda.com/search/part/LTC6655BHMS8-5#PBF/?ref=eda; Check_prices: https://www.snapeda.com/parts/LTC6655BHMS8-5%23PBF/Analog+Devices/view-part/?ref=eda; Value: *; SnapEDA_Link: https://www.snapeda.com/parts/LTC6655BHMS8-5%23PBF/Analog+Devices/view-part/?ref=snap; Package: None; Availability: In Stock; Price: None; MP: LTC6655BHMS8-5#PBF

## Sheet power_hall_crossboard_1_1.SchDoc
size A3
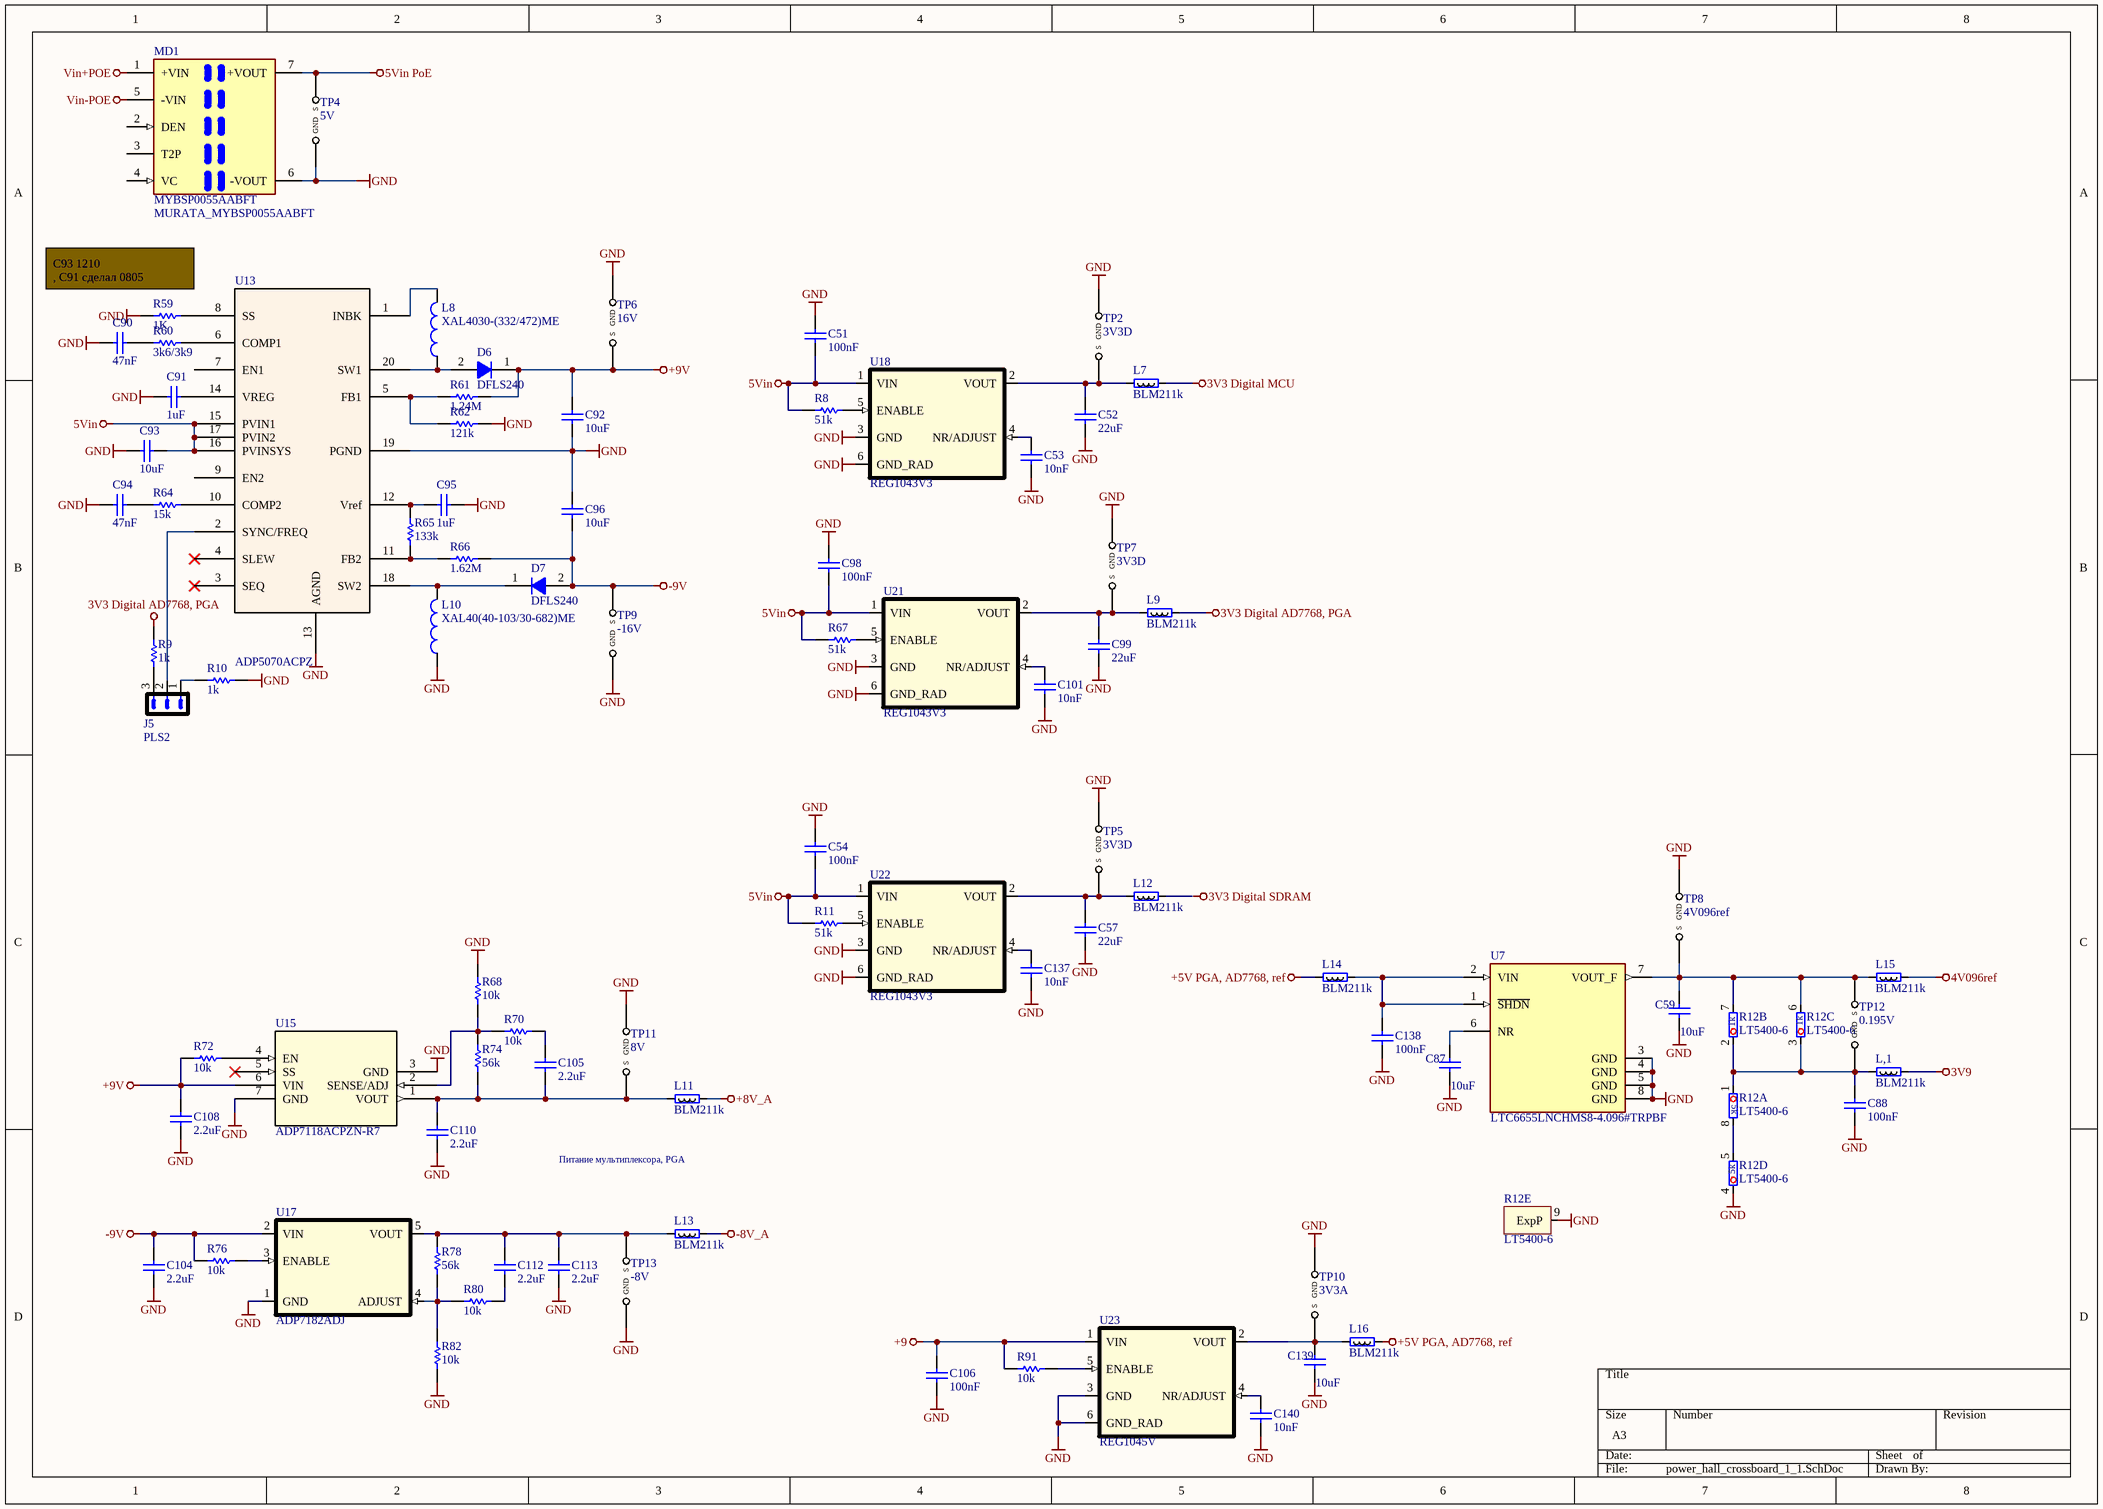
[diagram p9: power_hall_crossboard_1_1.SchDoc]

### Parts
C51  100nF  [0603C]
C52  22uF  [0805C]
C53  10nF  [0603C]
C54  100nF  [0603C]
C57  22uF  [0805C]
C59  10uF  [0805C]
C87  10uF  [0805C]
C88  100nF  [0603C]
C90  47nF  [0603C]
C91  1uF  [0805C]
C92  10uF  [0805C]
C93  10uF  [0805C]
C94  47nF  [0603C]
C95  1uF  [0805C]
C96  10uF  [0805C]
C98  100nF  [0603C]
C99  22uF  [0805C]
C101  10nF  [0603C]
C104  2.2uF  [0805C]
C105  2.2uF  [0805C]
C106  100nF  [0603C]
C108  2.2uF  [0805C]
C110  2.2uF  [0805C]
C112  2.2uF  [0805C]
C113  2.2uF  [0805C]
C137  10nF  [0603C]
C138  100nF  [0603C]
C139  10uF  [0805C]
C140  10nF  [0603C]
D6  DFLS240  [DFLS240]
D7  DFLS240  [DFLS240]
J5  PLS2  [COMATEL_385.0358.1.03.400]
L7  BLM211k  [RESC2012X50N]
L8  XAL4030-(332/472)ME  [XAL40]
L9  BLM211k  [RESC2012X50N]
L10  XAL40(40-103/30-682)ME  [XAL40]
L11  BLM211k  [RESC2012X50N]
L12  BLM211k  [RESC2012X50N]
L13  BLM211k  [RESC2012X50N]
L14  BLM211k  [RESC2012X50N]
L15  BLM211k  [RESC2012X50N]
L16  BLM211k  [RESC2012X50N]
L,1  BLM211k  [RESC2012X50N]
MD1  MURATA_MYBSP0055AABFT  [MURATA_MYBSP0055AABFT_0]
R8  51k  [0603R]
R9  1k  [0603R]
R10  1k  [0603R]
R11  51k  [0603R]
R12  LT5400-6  [SOP65P488X110-9N-R178X241]  (parts A,B,C,D,E of 5)
R59  1K  [0603R]
R60  3k6/3k9  [0603R]
R61  1.24M  [0603R]
R62  121k  [0603R]
R64  15k  [0603R]
R65  133k  [0603R]
R66  1.62M  [0603R]
R67  51k  [0603R]
R68  10k  [0603R]
R70  10k  [0603R]
R72  10k  [0603R]
R74  56k  [0603R]
R76  10k  [0603R]
R78  56k  [0603R]
R80  10k  [0603R]
R82  10k  [0603R]
R91  10k  [0603R]
TP2  3V3D  [TP2]
TP4  5V  [TP2]
TP5  3V3D  [TP2]
TP6  16V  [TP2]
TP7  3V3D  [TP2]
TP8  4V096ref  [TP2]
TP9  -16V  [TP2]
TP10  3V3A  [TP2]
TP11  8V  [TP2]
TP12  0.195V  [TP2]
TP13  -8V  [TP2]
U7  LTC6655LNCHMS8-4.096#TRPBF  [SOP65P490X110-8N]
U13  ADP5070ACPZ  [QFN50P400X400X100-21N-S265]
U15  ADP7118ACPZN-R7  [CP-6-3_ADI-M]
U17  ADP7182ADJ  [SOT23-5]
U18  REG1043V3  [SOT223_6-127]
U21  REG1043V3  [SOT223_6-127]
U22  REG1043V3  [SOT223_6-127]
U23  REG1045V  [SOT223_6-127]

### Nets
3V3 Digital AD7768, PGA: L9.2 R9.1
3V3 Digital MCU: L7.2
3V9: L,1.2
4V096ref: L15.2
5Vin: C51.1 C54.1 C93.2 C98.1 R8.1 R11.1 R67.1 U13.15(PVIN1) U13.16(PVINSYS) U13.17(PVIN2) U18.1(VIN) U21.1(VIN) U22.1(VIN)
5Vin PoE: MD1.7(+VOUT) TP4.1(S)
+5V PGA, AD7768, ref: L14.1 L16.2
+8V_A: L11.2
+9: C106.1 R91.1 U23.1(VIN)
+9V: C92.2 C108.2 D6.1(K) R61.2 R72.1 TP6.1(S) U15.6(VIN)
-8V_A: L13.2
-9V: C96.1 C104.2 D7.2(A) R66.2 R76.1 TP9.1(S) U17.2(VIN)
GND: C51.2 C52.1 C53.1 C54.2 C57.1 C59.1 C87.1 C88.1 C90.1 C91.1 C92.1 C93.1 C94.1 C95.1 C96.2 C98.2 C99.1 C101.1 C104.1 C106.2 C108.1 C110.1 C113.1 C137.1 C138.1 C139.1 C140.1 L10.1 MD1.6(-VOUT) R10.1 R12.4 R12.9(ExpP) R59.1 R62.2 R68.1 R82.2 TP2.2(GND) TP4.2(GND) TP5.2(GND) TP6.2(GND) TP7.2(GND) TP8.2(GND) TP9.2(GND) TP10.2(GND) TP11.2(GND) TP13.2(GND) U7.3(GND) U7.4(GND) U7.5(GND) U7.8(GND) U13.13(AGND) U13.19(PGND) U15.3(GND) U15.7(GND) U17.1(GND) U18.3(GND) U18.6(GND_RAD) U21.3(GND) U21.6(GND_RAD) U22.3(GND) U22.6(GND_RAD) U23.3(GND) U23.6(GND_RAD)  [project net Pt_100+]
Vin+POE: MD1.1(+VIN)
Vin-POE: MD1.5(-VIN)
NetC52_2: C52.2 L7.1 TP2.1(S) U18.2(VOUT)
NetC53_2: C53.2 U18.4(NR/ADJUST)
NetC57_2: C57.2 L12.1 TP5.1(S) U22.2(VOUT)
NetC59_2: C59.2 L15.1 R12.6 R12.7 TP8.1(S) TP12.1(S) U7.7(VOUT_F)
NetC87_2: C87.2 U7.6(NR)
NetC88_2: C88.2 L,1.1 R12.1 R12.2 R12.3 TP12.2(GND)
NetC90_2: C90.2 R60.1
NetC91_2: C91.2 U13.14(VREG)
NetC94_2: C94.2 R64.1
NetC95_2: C95.2 R65.2 U13.12(Vref)
NetC99_2: C99.2 L9.1 TP7.1(S) U21.2(VOUT)
NetC101_2: C101.2 U21.4(NR/ADJUST)
NetC105_1: C105.1 C110.2 L11.1 R74.2 TP11.1(S) U15.1(VOUT)
NetC105_2: C105.2 R70.2
NetC112_1: C112.1 R80.2
NetC112_2: C112.2 C113.2 L13.1 R78.1 TP13.1(S) U17.5(VOUT)
NetC137_2: C137.2 U22.4(NR/ADJUST)
NetC138_2: C138.2 L14.2 U7.1(~{SHDN}) U7.2(VIN)
NetC139_2: C139.2 L16.1 TP10.1(S) U23.2(VOUT)
NetC140_2: C140.2 U23.4(NR/ADJUST)
NetD6_2: D6.2(A) L8.1 U13.20(SW1)
NetD7_1: D7.1(K) L10.2 U13.18(SW2)
NetJ5_1: J5.1 R10.2
NetJ5_2: J5.2 U13.2(SYNC/FREQ)
NetJ5_3: J5.3 R9.2
NetL8_2: L8.2 U13.1(INBK)
NetR8_2: R8.2 U18.5(ENABLE)
NetR11_2: R11.2 U22.5(ENABLE)
NetR12_5: R12.5 R12.8
NetR59_2: R59.2 U13.8(SS)
NetR60_2: R60.2 U13.6(COMP1)
NetR61_1: R61.1 R62.1 U13.5(FB1)
NetR64_2: R64.2 U13.10(COMP2)
NetR65_1: R65.1 R66.1 U13.11(FB2)
NetR67_2: R67.2 U21.5(ENABLE)
NetR68_2: R68.2 R70.1 R74.1 U15.2(SENSE/ADJ)
NetR72_2: R72.2 U15.4(EN)
NetR76_2: R76.2 U17.3(ENABLE)
NetR78_2: R78.2 R80.1 R82.1 U17.4(ADJUST)
NetR91_2: R91.2 U23.5(ENABLE)

Not connected (* = marked no-connect by the designer): L12 2; MD1 2(DEN) 3(T2P) 4(VC); U13 3(SEQ)* 4(SLEW)* 7(EN1) 9(EN2); U15 5(SS)*

### Notes on the sheet
- (near R59) C93 1210
  , C91 сделал 0805
- Питание мультиплексора, PGA
- Labels drawn without touching a wire or pin: 3V3 Digital SDRAM
- (in symbol LT5400, part A) 5k
- (in symbol LT5400, part B) 1k
- (in symbol LT5400, part C) 1k
- (in symbol LT5400, part D) 5k

### Library data of the parts
C51-C54 C57 C88 C90-C96 C98 C99 C101 C104-C106 C108 C110 C112 C113 C137 C138 C140 = Capacitor_ST: Capacitor 0402 / 0603 / 0805; Revision: July-2002: Re-released for DXP Platform.
  C51 C54 C88 C98 C106 C138: Value: 100nF
  C52 C57 C99: Value: 22uF
  C53 C101 C137 C140: Value: 10nF
  C90 C94: Value: 47nF
  C91 C95: Value: 1uF
  C92 C93 C96: Value: 10uF
  C104 C105 C108 C110 C112 C113: Value: 2.2uF
C59 C87 C139 = Capacitor_ST: Value: 10uF
D6 D7 = DFLS240: 2.0A SURFACE MOUNT SCHOTTKY BARRIER RECTIFIER
J5 = PLS3: as J23 on sheet one_planar_sensor_connector_hall_crossboard_1_1; Price: 1; Device: PLS2
L7 L9 L11-L16 L,1 = BLM21: as L3 on sheet one_planar_sensor_connector_hall_crossboard_1_1; Device: BLM21; Price: 10
L8 = XAL40: Fixed Inductors 3.3/4.7uH Shld 20% 3.1A 92.4mOhms AECQ2; MF: Coilcraft; MP: XAL4040103ME; SnapEDA_Link: https://www.snapeda.com/parts/XAL4040103ME/Coilcraft/view-part/?ref=snap; Package: None; Value: 30-(332/472)ME; Check_prices: https://www.snapeda.com/parts/XAL4040103ME/Coilcraft/view-part/?ref=eda
L10 = XAL40: Fixed Inductors 6.8/10uH Shld 20% 3.1A 92.4mOhms AECQ2; MF: Coilcraft; MP: XAL4040103ME; SnapEDA_Link: https://www.snapeda.com/parts/XAL4040103ME/Coilcraft/view-part/?ref=snap; Package: None; Value: (40-103/30-682)ME; Check_prices: https://www.snapeda.com/parts/XAL4040103ME/Coilcraft/view-part/?ref=eda
MD1 = MURATA_MYBSP0055AABFT: Isolated PoE Module DC DC Converter 1 Output 5V - - - 5.1A 37V - 57V Input; MF: Murata Power Solutions Inc.; Package: SMD-7 Murata Power Solutions Inc.; Price: None; Check_prices: https://www.snapeda.com/parts/MYBSP0055AABFT/Murata/view-part/?ref=eda; Value: *; SnapEDA_Link: https://www.snapeda.com/parts/MYBSP0055AABFT/Murata/view-part/?ref=snap; MP: MYBSP0055AABFT; Availability: In Stock; Purchase-URL: https://pricing.snapeda.com/search/part/MYBSP0055AABFT/?ref=eda
R8-R11 R59-R62 R65-R68 R70 R72 R76 R80 R82 R91 = Resistor_ST: Resistor 0402 / 0603 / 0805
  R8 R11 R67: Value: 51k
  R9 R10: Value: 1k
  R59: Value: 1K
  R60: Value: 3k6/3k9
  R61: Value: 1.24M
  R62: Value: 121k
  R65: Value: 133k
  R66: Value: 1.62M
  R68 R70 R72 R76 R80 R82 R91: Value: 10k
R12 = LT5400: 4 прецизионных резистора; Vendor: Analog Devices; SMD Solders: 0; Solder Option: i; TC: 200ppb/C; Tolerance: 0..025%; Pkg: MSOP 9-0.65; Pwr: 40C/W; Name to order: LT5400BMPMS8E-6#PBF; Value: -6; Price: 2; Device: LT5400; THD Solders: 0
R64 = Resistor_ST: Resistor 0402 / 0603 / 0805 c2; Value: 15k
R74 R78 = Resistor_ST: Resistor; Ordered by: Subcon; Published: 8-Jun-2000; Revision: July-2002: Re-released for DXP Platform.; Publisher: Altium Limited; Value: 56k
TP2 TP5 TP7 TP10 = OscTP: as TP14 on sheet source_of_current_hall_crossboard_1_1; Price: 0; SolderOption: PCB
  TP2 TP5 TP7: Value: 3V3D
  TP10: Value: 3V3A
TP4 TP6 TP8 TP9 TP11-TP13 = OscTP: as TP1 on sheet one_planar_sensor_connector_hall_crossboard_1_1; Price: 0; SolderOption: PCB
  TP4: Value: 5V
  TP6: Value: 16V
  TP8: Value: 4V096ref
  TP9: Value: -16V
  TP11: Value: 8V
  TP12: Value: 0.195V
  TP13: Value: -8V
U7 = LTC6655LNCHMS8-4.096#TRPBF: 0.25ppm Noise, Low Drift Precision References; MF: Analog Devices; SnapEDA_Link: https://www.snapeda.com/parts/LTC6655LNCHMS8-4.096%23TRPBF/Analog+Devices/view-part/?ref=snap; Package: MSOP-8 Analog Devices; Value: *; MP: LTC6655LNCHMS8-4.096#TRPBF; Check_prices: https://www.snapeda.com/parts/LTC6655LNCHMS8-4.096%23TRPBF/Analog+Devices/view-part/?ref=eda
U13 = ADP5070ACPZ: 1 A/0.6 A, DC-to-DC Switching Regulator with / Independent Positive and Negative Outputs
U15 = ADP7118ACPZN-R7: No Description Available; Mfr_Name: Analog Devices Inc; Type: Power Management; RefDes: RefDes
U17 = ADP7182: Negative LDO Linear stabilizer; Vendor: Analog Devoces; Value: ADJ; SMD Solders: 5; Solder Option: RM; Name to order: ADP7182AUJZ-R7; Vref: 1V22; Pkg: SOT23-5; Price: 100; Device: ADP7182
U18 U21 U22 = REG104_5V: Positive LDO Linear stabilizer 5Vin to 3V3Digital; Vendor: Texas Instruments; Device: REG104; Value: 3V3; SMD Solder: 6; THD Solder: 0; Step: 2; Unit Price: 6; Package: SOT223-6; SolderOption: 0
U23 = REG104_5V: Positive LDO Linear stabilizer 5Vin to 3V3Digital; Vendor: Texas Instruments; Device: REG104; Value: 5V; SMD Solder: 6; THD Solder: 0; Step: 2; Unit Price: 6; Package: SOT223-6; SolderOption: 0